# Altium project e-puck3-camera.PrjPcb
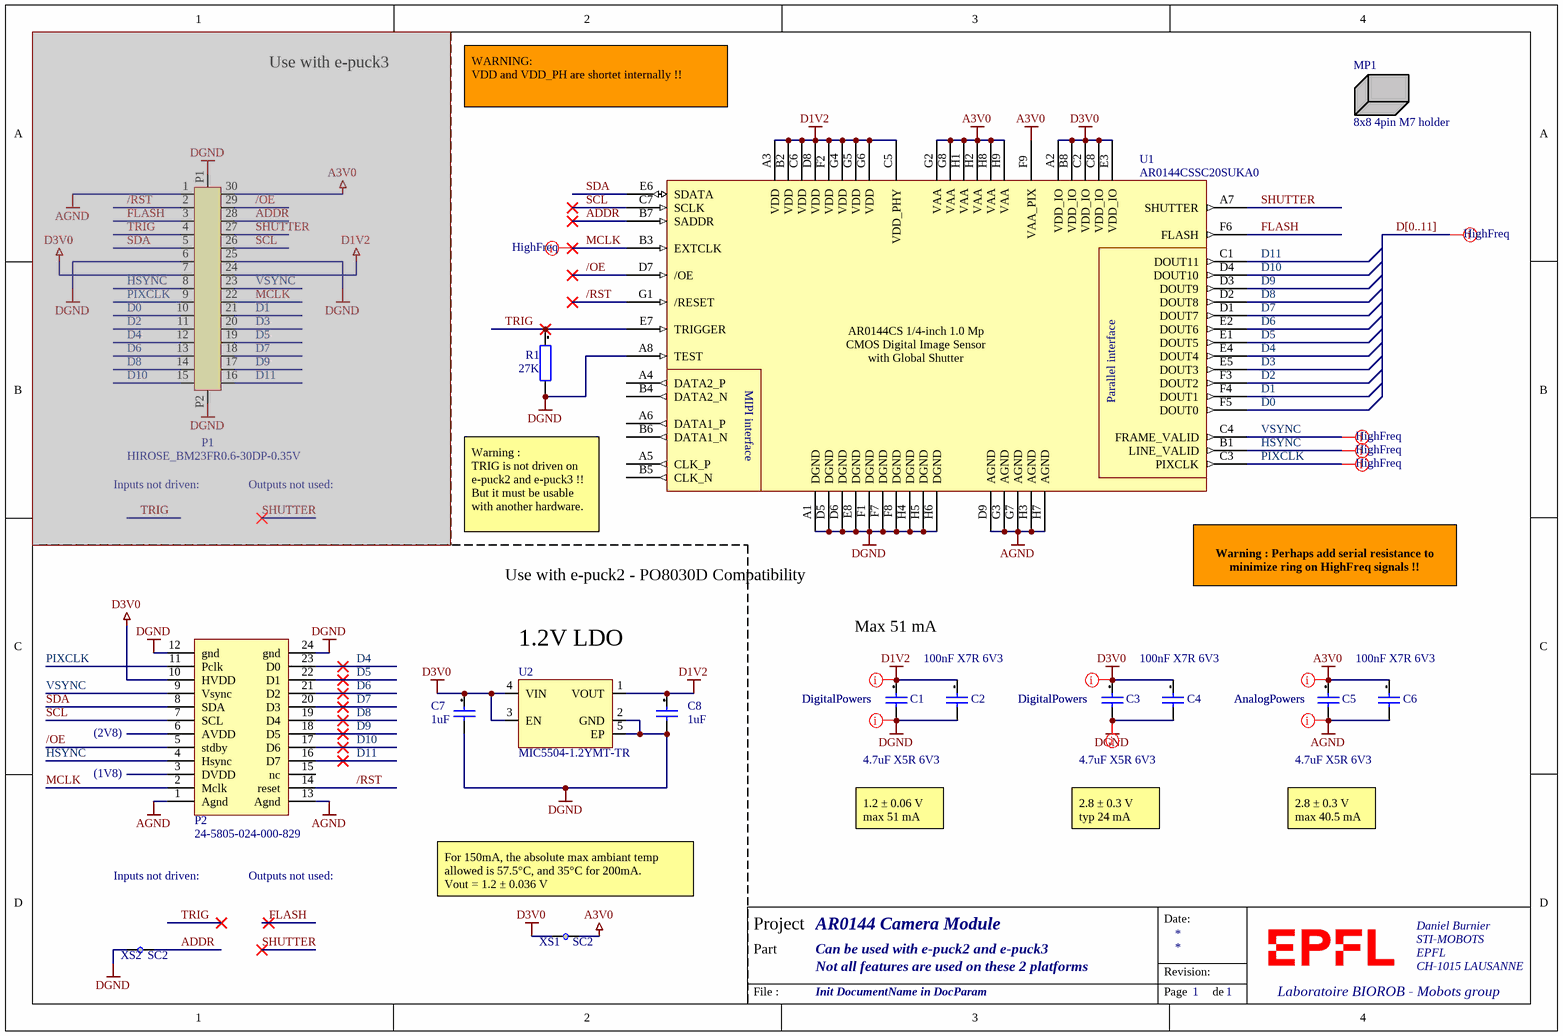
[diagram p0: e-puck3-camera.SchDoc]
Project_Revision: A; Project_Name: AR0144 Camera Module; Organization_Name: Laboratoire BIOROB - Mobots group
1 sheet, 16 parts. Net scope: global (net labels, ports and power ports of the same name join across sheets).
Board file: e-puck3-camera.PcbDoc

## Sheet e-puck3-camera.SchDoc: Can be used with e-puck2 and e-puck3
size A4; Organization: Use Organization_Name in ProjParam; Address1: Daniel Burnier; Address2: STI-MOBOTS; Address3: EPFL; Address4: CH-1015 LAUSANNE; DocumentNumber: Init DocumentNumber in DocParam; Revision: A; SheetNumber: 1; SheetTotal: 1; ApprovedBy: Init ApprovedBy in DocParam; CheckedBy: Init CheckedBy in DocParam; Author: Init Author in DocParam; CompanyName: Init CompanyName in DocParam; DrawnBy: Init DrawBy in DocParam; Engineer: Init Engineer in DocParam; Title2: Not all features are used on these 2 platforms; DocumentName: Init DocumentName in DocParam; ProjectName: Init ProjectName in DocParam

### Parts
C1  4.7uF X5R 6V3  [CAPC0201(0603)33_L]
C2  100nF X7R 6V3  [CAPC0201(0603)33_L]
C3  4.7uF X5R 6V3  [CAPC0201(0603)33_L]
C4  100nF X7R 6V3  [CAPC0201(0603)33_L]
C5  4.7uF X5R 6V3  [CAPC0201(0603)33_L]
C6  100nF X7R 6V3  [CAPC0201(0603)33_L]
C7  1uF  [CAPC0201(0603)33_L]
C8  1uF  [CAPC0201(0603)33_L]
MP1  8x8 4pin M7 holder  [CASE1_AR0144]
P1  HIROSE_BM23FR0.6-30DP-0.35V  [HIROSE_BM23FR0.6-30DP-0.35V]  (masked out: inside a compile mask, not in the netlist)
P2  24-5805-024-000-829  [Connector 24-5805-024-000-829]
R1  27K  [RESC0201(0603)_L]
U1  AR0144CSSC20SUKA0  [ONSEMI-ODCSP69_570BBV]
U2  MIC5504-1.2YMT-TR  [TDFN-4]
XS1  SC2  [CC_SC2]  (net tie, no BOM)
XS2  SC2  [CC_SC2]  (net tie, no BOM)

### Nets
A3V0: C5.1 C6.1 U1.F9(VAA_PIX) U1.G2(VAA) U1.G8(VAA) U1.H1(VAA) U1.H2(VAA) U1.H8(VAA) U1.H9(VAA) XS1.1
AGND: C5.2 C6.2 P2.1(Agnd) P2.13(Agnd) U1.D9(AGND) U1.G3(AGND) U1.G7(AGND) U1.H3(AGND) U1.H7(AGND)
D1V2: C1.1 C2.1 C8.1 U1.A3(VDD) U1.B2(VDD) U1.C5(VDD_PHY) U1.C6(VDD) U1.D8(VDD) U1.F2(VDD) U1.G4(VDD) U1.G5(VDD) U1.G6(VDD) U2.1(VOUT)
D3V0: C3.1 C4.1 C7.1 P2.10(HVDD) U1.A2(VDD_IO) U1.B8(VDD_IO) U1.C2(VDD_IO) U1.C8(VDD_IO) U1.E3(VDD_IO) U2.3(EN) U2.4(VIN) XS1.2
DGND: C1.2 C2.2 C3.2 C4.2 C7.2 C8.2 P2.12(gnd) P2.24(gnd) R1.2 U1.A1(DGND) U1.A8(TEST) U1.D5(DGND) U1.D6(DGND) U1.E8(DGND) U1.F1(DGND) U1.F7(DGND) U1.F8(DGND) U1.H4(DGND) U1.H5(DGND) U1.H6(DGND) U2.2(GND) U2.5(EP) XS2.2
/OE: P2.5(stdby) U1.D7(/OE)
/RST: P2.14(reset) U1.G1(/RESET)
ADDR: U1.B7(SADDR) XS2.1
D0: U1.F5(DOUT0)
D1: U1.F4(DOUT1)
D2: U1.F3(DOUT2)
D3: U1.E5(DOUT3)
D4: P2.23(D0) U1.E4(DOUT4)
D5: P2.22(D1) U1.E1(DOUT5)
D6: P2.21(D2) U1.E2(DOUT6)
D7: P2.20(D3) U1.D1(DOUT7)
D8: P2.19(D4) U1.D2(DOUT8)
D9: P2.18(D5) U1.D3(DOUT9)
D10: P2.17(D6) U1.D4(DOUT10)
D11: P2.16(D7) U1.C1(DOUT11)
FLASH: U1.F6(FLASH)
HSYNC: P2.4(Hsync) U1.B1(LINE_VALID)
MCLK: P2.2(Mclk) U1.B3(EXTCLK)
PIXCLK: P2.11(Pclk) U1.C3(PIXCLK)
SCL: P2.7(SCL) U1.C7(SCLK)
SDA: P2.8(SDA) U1.E6(SDATA)
SHUTTER: U1.A7(SHUTTER)
TRIG: R1.1 U1.E7(TRIGGER)
VSYNC: P2.9(Vsync) U1.C4(FRAME_VALID)

Not connected (* = marked no-connect by the designer): MP1 0; P2 3(DVDD) 6(AVDD) 15(nc); U1 A4(DATA2_P) A5(CLK_P) A6(DATA1_P) B4(DATA2_N) B5(CLK_N) B6(DATA1_N)

### Buses and harness runs
bus D[0..11]

### Layout directives
net class AnalogPowers: A3V0, AGND
net class DigitalPowers: D1V2, D3V0, DGND
net class HighFreq: (no net found under the mark), HSYNC, MCLK, PIXCLK, VSYNC

### Notes on the sheet
- Use with e-puck3
- WARNING:
  VDD and VDD_PH are shortet internally !!
- (near P1) Demander à Eliot de modifier la Core:
  Toutes les PU et PD doivent respecter un Input Leakage Current de 20 + 3 uA donc : 10K ≤ Rmax ≤ 33K
  Pour TRIG, j'ai mis une PD de 27K
- Inputs not driven:
- Outputs not used:
- Warning :
  TRIG is not driven on e-puck2 and e-puck3 !!
  But it must be usable with another hardware.
- Use with e-puck2 - PO8030D Compatibility
- (near U1) Warning : Perhaps add serial resistance to minimize ring on HighFreq signals !!
- (near U2) 1.2V LDO
- Max 51 mA
- (1V8)
- (2V8)
- 1.2 ± 0.06 V
  max 51 mA
- 2.8 ± 0.3 V
  typ 24 mA
- 2.8 ± 0.3 V
  max 40.5 mA
- (near XS1) For 150mA, the absolute max ambiant temp allowed is 57.5°C, and 35°C for 200mA.
  Vout = 1.2 ± 0.036 V
- Date:
- Project
- Part
- Revision:
- File :
- Page
- de
- (in symbol AR0144CS[[/\]]1) AR0144CS 1/4‐inch 1.0 Mp CMOS Digital Image Sensor with Global Shutter; MIPI interface; Parallel interface

### Library data of the parts
C1 C3 C5 = TBD Capacitor[[/\]]0201[[/\]]1: Capacitor TBD 0201; Manufacturer: Murata; Manufacturer Part Number: GRM035R60J475ME15D; Preference: 1; Currentie: CHF; Voltage Rating: 6.3V; Tolerance: 20%; Size: 0201; Footprint Acort: 0201; ROHS: True; DateLastUpdate: 2018-10-19 / 8:59:52 AM; Supplier 1: Digi-Key; Supplier Part Number 1: 490-13230-1-ND; Stock 1: 1746304; Pricing 1: 1=0.44000, 10=0.30700, 100=0.18420, 500=0.13818, 1000=0.11668, 2500=0.11054, 5000=0.10440 (USD); Mount: Surface Mount; Case/Package: 0201; Case Code (Metric): 0603; Case Code (Imperial): 0201; Min Operating Temperature: -55°C; Max Operating Temperature: 85°C; Packaging: Tape and Reel; Capacitance: 4.7uF; Voltage Rating (DC): 6.3V; Dielectric: X5R; Length: 0.024inch; Width: 0.012inch; Thickness: 0.022inch; ComponentLink1URL: http://search.murata.co.jp/Ceramy/image/img/A01X/G101/ENG/GRM035R60J475ME15-01.pdf?src-supplier=Digi-Key; ComponentLink1Description: http://search.murata.co.jp/Ceramy/image/img/A01X/G101/ENG/GRM035R60J475ME15-01.pdf?src-supplier=Digi-Key
C2 C4 C6-C8 = TBD Capacitor[[/\]]0201[[/\]]1: Capacitor TBD 0201; Preference: 1; Currentie: CHF; Size: 0201; Footprint Acort: 0201; ROHS: True; DateLastUpdate: 2018-10-19 / 8:59:52 AM
MP1 = Case: Any kind of case
P1 = HIROSE_BM23FR0.6-30DP-0.35V[[/\]]1: 2 x 15 Hirose header BM23FR0.6 Serie, 0.35 pitch, SMD, Mate at 0.6mm with receptacle, 0.3A signal contacts; Preference: 1; Currentie: CHF; Footprint Acort: ToDefine; ComponentLink1Description: Supplier link; ComponentLink1URL: https://www.hirose.com/product/series/BM23FR?lang=en; Supplier: Mouser; Supplier Nr: 798-3FR0630DP035V895; Manufacturer: Hirose; Manufacturer Nr: BM23FR0.6-30DP-0.35V; ROHS: True; Type: SMD; Orientation: Vertical; DateLastUpdate: 2019-09-24 / 11:10:53 AM; Quant_1: 1; Price_1: 1.03
P2 = 24-5805-024-000-829: RCPT 24 pins camera 24-5805-024-000-829; value: 24-5805-024-000-829
R1 = TBD[[/\]]0201[[/\]]1: Resistor ToDo 0201; Preference: 1; Currentie: CHF; Size: 0201; Footprint Acort: 0201; ROHS: True; DateLastUpdate: 2018-10-19 / 9:06:49 AM
U1 = AR0144CS[[/\]]1: AR0144CS 1/4-inch 1.0 Mp CMOS Digital Image Sensor with Global Shutter; Manufacturer: OnSemiconductor; Manufacturer Nr: ToDefine; Preference: 1; Currentie: CHF; Size: SOIC16; Footprint Acort: ToDefine; ComponentLink1Description: OnSemiconductor link; ComponentLink1URL: https://www.onsemi.com/PowerSolutions/search.do?searchType=others&query=AR0144; Supplier: Farnell; Supplier Nr: ToDefine; ROHS: True; DateLastUpdate: 2019-09-20 / 2:14:32 PM
U2 = MIC5504-1.2YMT-TR: IC REG LINEAR 1.2V 300MA 4TDFN; Manufacturer: Microchip; Dropout Voltage: 160mV; Number of Regulators: 1; Min Current Limit: 400mA; Supplier 1: Digi-Key; Stock 1: 2603; Pricing 1: 1 = 0,16000, 25 = 0,13400, 100 = 0,12360 (USD); RoHS: Yes; Mount: Surface Mount; Min Operating Temperature: -40°C; Max Operating Temperature: 125°C; Packaging: Tape and Reel; Output Voltage: 1.2V; Output Current: 300mA; ComponentLink1URL: http://www.microchip.com/mymicrochip/filehandler.aspx?ddocname=en580292&src-supplier=Digi-Key; ComponentLink1Description: http://www.microchip.com/mymicrochip/filehandler.aspx?ddocname=en580292&src-supplier=Digi-Key; Supplier Part Number 1: MIC5504-1.2YMT-CT-ND; Manufacturer Part Number: MIC5504-1.2YMT-TR
XS1 XS2 = SC2: Short Circuit 2 Connections